# EAGLE design cft-bus-hold (EAGLE 5.11)
DRAWN_BY: Alexios; PROJECT_NAME: CFT Mini-Computer; REVISION: Rev A; SHEET_DESCRIPTION: Bus Hold; SIMULATION_FILENAME: N/A; URL: http://www.bedroomlan.org/cft
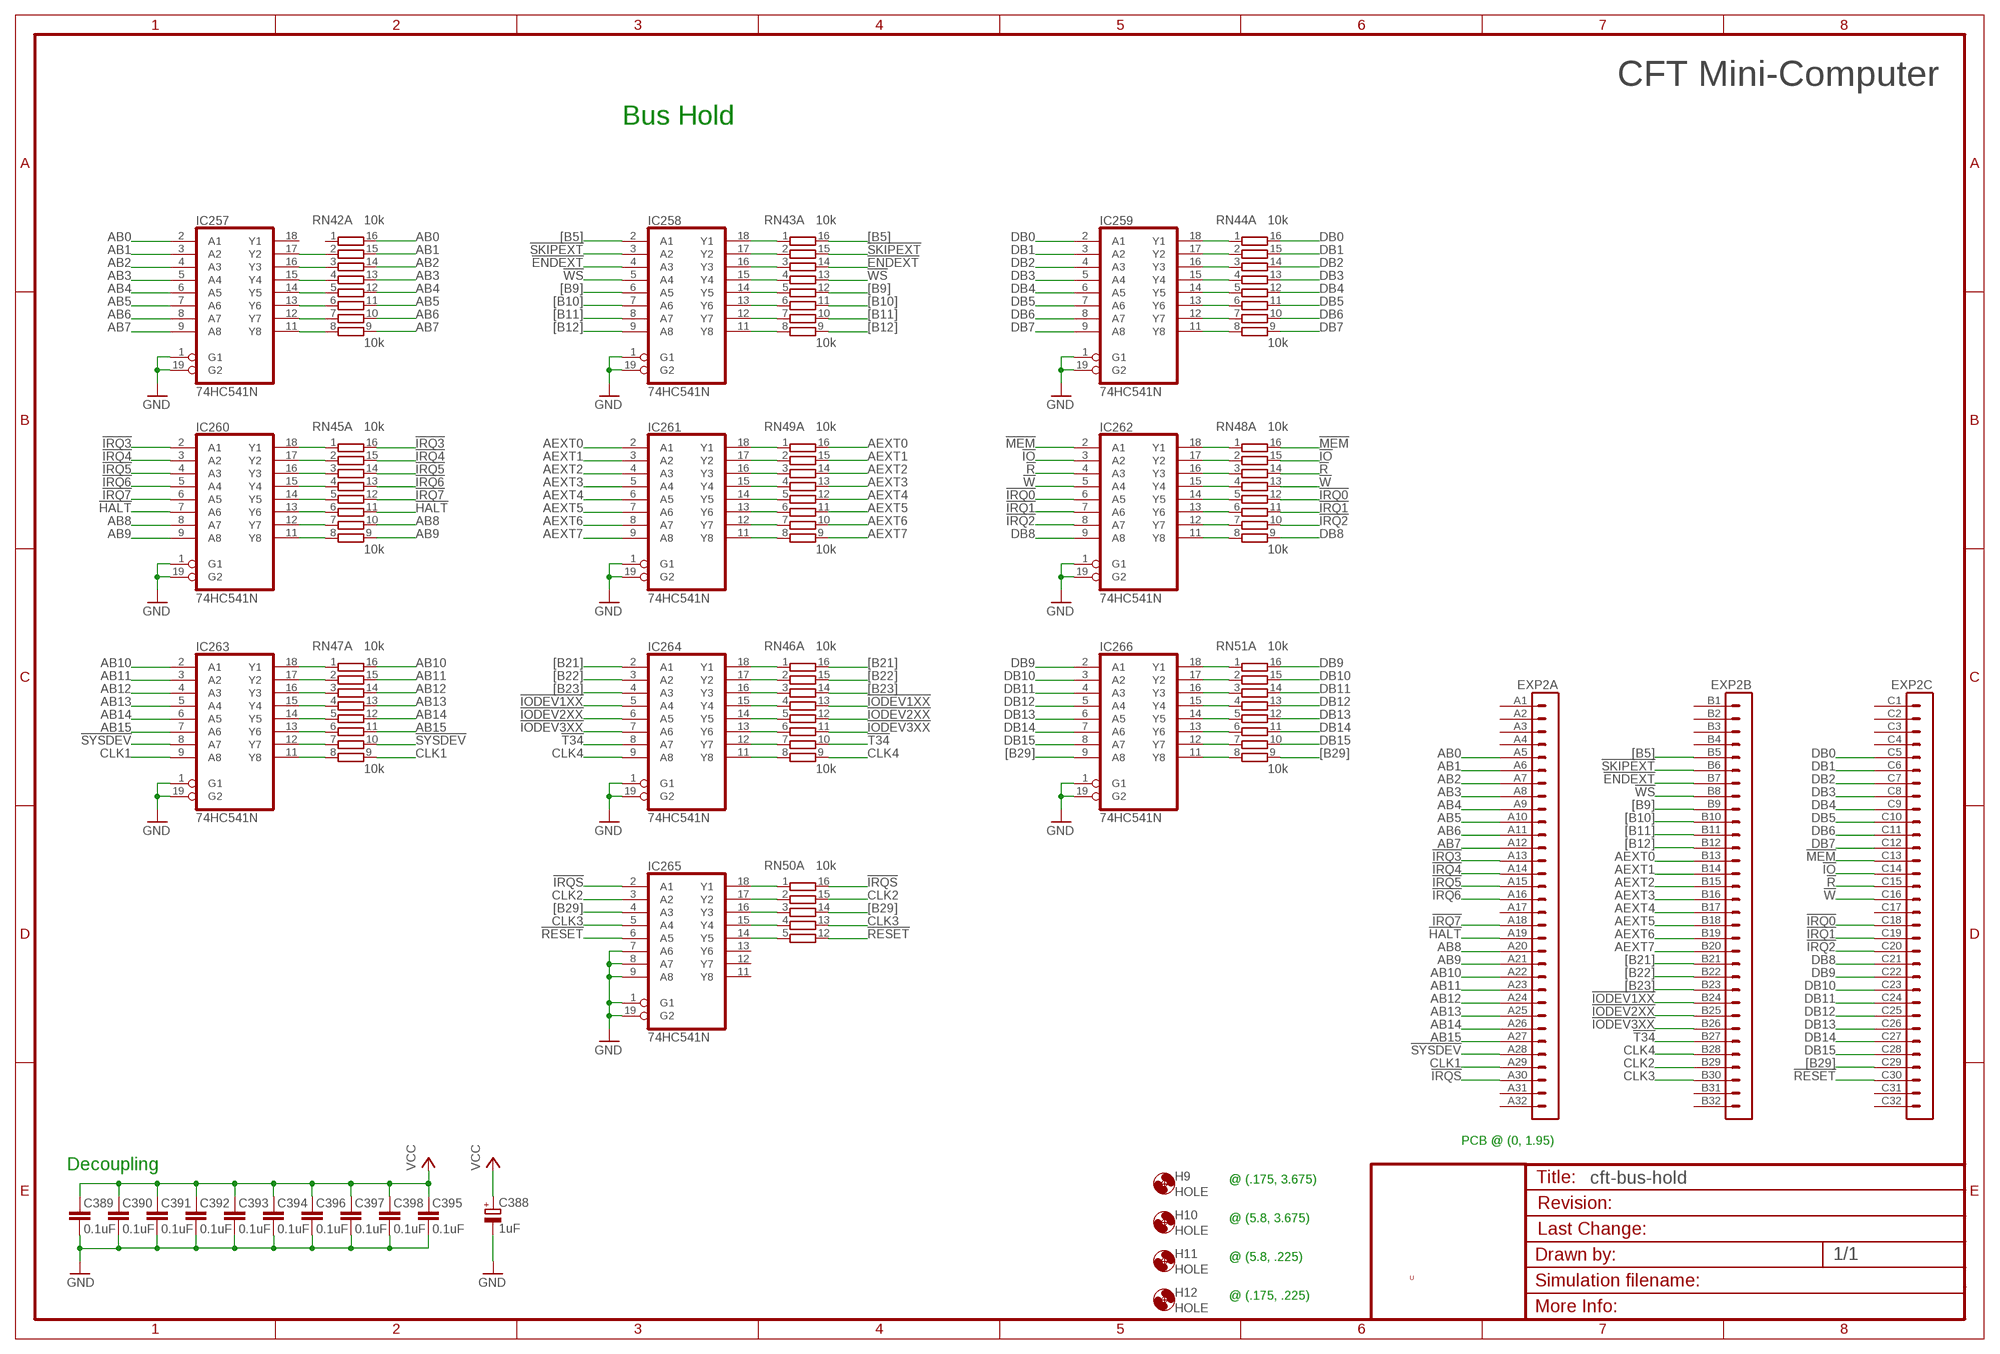
[diagram p0: schematic, sheet 1]

## Parts
C388  1uF  CPOL-EUE2.5-5  [E2,5-5]
C389  0.1uF  C-EU025-024X044  [C025-024X044]
C390  0.1uF  C-EU025-024X044  [C025-024X044]
C391  0.1uF  C-EU025-024X044  [C025-024X044]
C392  0.1uF  C-EU025-024X044  [C025-024X044]
C393  0.1uF  C-EU025-024X044  [C025-024X044]
C394  0.1uF  C-EU025-024X044  [C025-024X044]
C395  0.1uF  C-EU025-024X044  [C025-024X044]
C396  0.1uF  C-EU025-024X044  [C025-024X044]
C397  0.1uF  C-EU025-024X044  [C025-024X044]
C398  0.1uF  C-EU025-024X044  [C025-024X044]
EXP2  VG96-3K  [VG96K]
H9  HOLE  [STANDOFF_28_60]
H10  HOLE  [STANDOFF_28_60]
H11  HOLE  [STANDOFF_28_60]
H12  HOLE  [STANDOFF_28_60]
IC257  74HC541N  [DIL20]
IC258  74HC541N  [DIL20]
IC259  74HC541N  [DIL20]
IC260  74HC541N  [DIL20]
IC261  74HC541N  [DIL20]
IC262  74HC541N  [DIL20]
IC263  74HC541N  [DIL20]
IC264  74HC541N  [DIL20]
IC265  74HC541N  [DIL20]
IC266  74HC541N  [DIL20]
RN42  10k  8R-N  [DIL16]
RN43  10k  8R-N  [DIL16]
RN44  10k  8R-N  [DIL16]
RN45  10k  8R-N  [DIL16]
RN46  10k  8R-N  [DIL16]
RN47  10k  8R-N  [DIL16]
RN48  10k  8R-N  [DIL16]
RN49  10k  8R-N  [DIL16]
RN50  10k  8R-N  [DIL16]
RN51  10k  8R-N  [DIL16]

## Nets
!ENDEXT: EXP2.B7 IC258.4(A3) RN43.14
!HALT: EXP2.A19 IC260.7(A6) RN45.11
!IO: EXP2.C14 IC262.3(A2) RN48.15
!IODEV1XX: EXP2.B24 IC264.5(A4) RN46.13
!IODEV2XX: EXP2.B25 IC264.6(A5) RN46.12
!IODEV3XX: EXP2.B26 IC264.7(A6) RN46.11
!IRQ0: EXP2.C18 IC262.6(A5) RN48.12
!IRQ1: EXP2.C19 IC262.7(A6) RN48.11
!IRQ2: EXP2.C20 IC262.8(A7) RN48.10
!IRQ3: EXP2.A13 IC260.2(A1) RN45.16
!IRQ4: EXP2.A14 IC260.3(A2) RN45.15
!IRQ5: EXP2.A15 IC260.4(A3) RN45.14
!IRQ6: EXP2.A16 IC260.5(A4) RN45.13
!IRQ7: EXP2.A18 IC260.6(A5) RN45.12
!IRQS: EXP2.A30 IC265.2(A1) RN50.16
!MEM: EXP2.C13 IC262.2(A1) RN48.16
!R: EXP2.C15 IC262.4(A3) RN48.14
!RESET: EXP2.C30 IC265.6(A5) RN50.12
!SKIPEXT: EXP2.B6 IC258.3(A2) RN43.15
!SYSDEV: EXP2.A28 IC263.8(A7) RN47.10
!T34: EXP2.B27 IC264.8(A7) RN46.10
!W: EXP2.C16 IC262.5(A4) RN48.13
!WS: EXP2.B8 IC258.5(A4) RN43.13
[B5]: EXP2.B5 IC258.2(A1) RN43.16
[B9]: EXP2.B9 IC258.6(A5) RN43.12
[B10]: EXP2.B10 IC258.7(A6) RN43.11
[B11]: EXP2.B11 IC258.8(A7) RN43.10
[B12]: EXP2.B12 IC258.9(A8) RN43.9
[B21]: EXP2.B21 IC264.2(A1) RN46.16
[B22]: EXP2.B22 IC264.3(A2) RN46.15
[B23]: EXP2.B23 IC264.4(A3) RN46.14
[B29]: EXP2.C29 IC265.4(A3) IC266.9(A8) RN50.14 RN51.9
AB0: EXP2.A5 IC257.2(A1) RN42.16
AB1: EXP2.A6 IC257.3(A2) RN42.15
AB2: EXP2.A7 IC257.4(A3) RN42.14
AB3: EXP2.A8 IC257.5(A4) RN42.13
AB4: EXP2.A9 IC257.6(A5) RN42.12
AB5: EXP2.A10 IC257.7(A6) RN42.11
AB6: EXP2.A11 IC257.8(A7) RN42.10
AB7: EXP2.A12 IC257.9(A8) RN42.9
AB8: EXP2.A20 IC260.8(A7) RN45.10
AB9: EXP2.A21 IC260.9(A8) RN45.9
AB10: EXP2.A22 IC263.2(A1) RN47.16
AB11: EXP2.A23 IC263.3(A2) RN47.15
AB12: EXP2.A24 IC263.4(A3) RN47.14
AB13: EXP2.A25 IC263.5(A4) RN47.13
AB14: EXP2.A26 IC263.6(A5) RN47.12
AB15: EXP2.A27 IC263.7(A6) RN47.11
AEXT0: EXP2.B13 IC261.2(A1) RN49.16
AEXT1: EXP2.B14 IC261.3(A2) RN49.15
AEXT2: EXP2.B15 IC261.4(A3) RN49.14
AEXT3: EXP2.B16 IC261.5(A4) RN49.13
AEXT4: EXP2.B17 IC261.6(A5) RN49.12
AEXT5: EXP2.B18 IC261.7(A6) RN49.11
AEXT6: EXP2.B19 IC261.8(A7) RN49.10
AEXT7: EXP2.B20 IC261.9(A8) RN49.9
CLK1: EXP2.A29 IC263.9(A8) RN47.9
CLK2: EXP2.B29 IC265.3(A2) RN50.15
CLK3: EXP2.B30 IC265.5(A4) RN50.13
CLK4: EXP2.B28 IC264.9(A8) RN46.9
DB0: EXP2.C5 IC259.2(A1) RN44.16
DB1: EXP2.C6 IC259.3(A2) RN44.15
DB2: EXP2.C7 IC259.4(A3) RN44.14
DB3: EXP2.C8 IC259.5(A4) RN44.13
DB4: EXP2.C9 IC259.6(A5) RN44.12
DB5: EXP2.C10 IC259.7(A6) RN44.11
DB6: EXP2.C11 IC259.8(A7) RN44.10
DB7: EXP2.C12 IC259.9(A8) RN44.9
DB8: EXP2.C21 IC262.9(A8) RN48.9
DB9: EXP2.C22 IC266.2(A1) RN51.16
DB10: EXP2.C23 IC266.3(A2) RN51.15
DB11: EXP2.C24 IC266.4(A3) RN51.14
DB12: EXP2.C25 IC266.5(A4) RN51.13
DB13: EXP2.C26 IC266.6(A5) RN51.12
DB14: EXP2.C27 IC266.7(A6) RN51.11
DB15: EXP2.C28 IC266.8(A7) RN51.10
GND [low power]: C388.- C389.1 C390.1 C391.1 C392.1 C393.1 C394.1 C395.1 C396.1 C397.1 C398.1 IC257.1(G1) IC257.19(G2) IC258.1(G1) IC258.19(G2) IC259.1(G1) IC259.19(G2) IC260.1(G1) IC260.19(G2) IC261.1(G1) IC261.19(G2) IC262.1(G1) IC262.19(G2) IC263.1(G1) IC263.19(G2) IC264.1(G1) IC264.19(G2) IC265.1(G1) IC265.7(A6) IC265.8(A7) IC265.9(A8) IC265.19(G2) IC266.1(G1) IC266.19(G2)
N$1: IC258.18(Y1) RN43.1
N$2: IC257.15(Y4) RN42.4
N$7: IC257.16(Y3) RN42.3
N$8: IC257.17(Y2) RN42.2
N$10: IC266.18(Y1) RN51.1
N$11: IC257.14(Y5) RN42.5
N$12: IC257.13(Y6) RN42.6
N$55: IC257.12(Y7) RN42.7
N$61: IC257.11(Y8) RN42.8
N$67: IC258.17(Y2) RN43.2
N$68: IC258.16(Y3) RN43.3
N$69: IC258.15(Y4) RN43.4
N$77: IC258.14(Y5) RN43.5
N$200: IC258.13(Y6) RN43.6
N$208: IC258.12(Y7) RN43.7
N$209: IC258.11(Y8) RN43.8
N$210: IC259.18(Y1) RN44.1
N$211: IC259.17(Y2) RN44.2
N$212: IC259.16(Y3) RN44.3
N$213: IC259.15(Y4) RN44.4
N$214: IC259.14(Y5) RN44.5
N$215: IC259.13(Y6) RN44.6
N$216: IC259.12(Y7) RN44.7
N$217: IC259.11(Y8) RN44.8
N$218: IC260.18(Y1) RN45.1
N$219: IC260.17(Y2) RN45.2
N$220: IC260.16(Y3) RN45.3
N$221: IC260.15(Y4) RN45.4
N$222: IC260.14(Y5) RN45.5
N$223: IC260.13(Y6) RN45.6
N$224: IC260.12(Y7) RN45.7
N$225: IC260.11(Y8) RN45.8
N$226: IC264.18(Y1) RN46.1
N$227: IC264.17(Y2) RN46.2
N$228: IC264.16(Y3) RN46.3
N$229: IC264.15(Y4) RN46.4
N$230: IC264.14(Y5) RN46.5
N$231: IC264.13(Y6) RN46.6
N$232: IC264.12(Y7) RN46.7
N$233: IC264.11(Y8) RN46.8
N$258: IC263.18(Y1) RN47.1
N$266: IC263.17(Y2) RN47.2
N$267: IC263.16(Y3) RN47.3
N$268: IC263.15(Y4) RN47.4
N$269: IC263.14(Y5) RN47.5
N$270: IC263.13(Y6) RN47.6
N$272: IC263.12(Y7) RN47.7
N$275: IC263.11(Y8) RN47.8
N$276: IC262.18(Y1) RN48.1
N$289: IC262.17(Y2) RN48.2
N$482: IC262.16(Y3) RN48.3
N$521: IC262.15(Y4) RN48.4
N$522: IC262.14(Y5) RN48.5
N$523: IC262.13(Y6) RN48.6
N$524: IC262.12(Y7) RN48.7
N$525: IC262.11(Y8) RN48.8
N$526: IC261.18(Y1) RN49.1
N$528: IC261.17(Y2) RN49.2
N$529: IC261.16(Y3) RN49.3
N$530: IC261.15(Y4) RN49.4
N$534: IC261.14(Y5) RN49.5
N$535: IC261.13(Y6) RN49.6
N$536: IC261.12(Y7) RN49.7
N$537: IC261.11(Y8) RN49.8
N$538: IC265.18(Y1) RN50.1
N$540: IC265.17(Y2) RN50.2
N$848: IC265.16(Y3) RN50.3
N$849: IC265.15(Y4) RN50.4
N$857: IC265.14(Y5) RN50.5
N$861: IC266.17(Y2) RN51.2
N$862: IC266.16(Y3) RN51.3
N$863: IC266.15(Y4) RN51.4
N$864: IC266.14(Y5) RN51.5
N$865: IC266.13(Y6) RN51.6
N$866: IC266.12(Y7) RN51.7
N$867: IC266.11(Y8) RN51.8
VCC [low power]: C388.+ C389.2 C390.2 C391.2 C392.2 C393.2 C394.2 C395.2 C396.2 C397.2 C398.2
Unconnected: EXP2.A1 EXP2.A2 EXP2.A3 EXP2.A4 EXP2.A17 EXP2.A31 EXP2.A32 EXP2.B1 EXP2.B2 EXP2.B3 EXP2.B4 EXP2.B31 EXP2.B32 EXP2.C1 EXP2.C2 EXP2.C3 EXP2.C4 EXP2.C17 EXP2.C31 EXP2.C32 IC257.18(Y1) IC265.11(Y8) IC265.12(Y7) IC265.13(Y6) RN42.1 RN50.6 RN50.7 RN50.8 RN50.9 RN50.10 RN50.11

## Notes on the sheet
- CFT Mini-Computer
- Bus Hold
- PCB @ (0, 1.95)
- Decoupling
- @ (.175, 3.675)
- @ (5.8, 3.675)
- @ (5.8, .225)
- U
- @ (.175, .225)

## Power pins joined to a net without a drawn wire
GND: IC257.10(GND) IC258.10(GND) IC259.10(GND) IC260.10(GND) IC261.10(GND) IC262.10(GND) IC263.10(GND) IC264.10(GND) IC265.10(GND) IC266.10(GND)
VCC: IC257.20(VCC) IC258.20(VCC) IC259.20(VCC) IC260.20(VCC) IC261.20(VCC) IC262.20(VCC) IC263.20(VCC) IC264.20(VCC) IC265.20(VCC) IC266.20(VCC)

## Library data of the parts
C388 = rcl:CPOL-EU: POLARIZED CAPACITOR, European symbol
C389-C398 = rcl:C-EU: CAPACITOR, European symbol
EXP2 = alexios-19inch:VG96-3: PCB EUROCARD, 96-pin type C/ABC, 2.54 mm
H9-H12 = alexios:HOLE: Hole for a standoff or mount. Hole diameter: 3.3mm. External Diameter: 6mm.
IC257-IC266 = alexios:74*541: Octal BUFFER and LINE DRIVER, 3-state
RN42-RN51 = resistor-dil:8R-N: DIL RESISTOR; OC_FARNELL: unknown; OC_NEWARK: unknown

## Net classes
0 default: width 0.305 mm, clearance 0.203 mm
1 low power: width 1.27 mm, clearance 0.254 mm

## Board
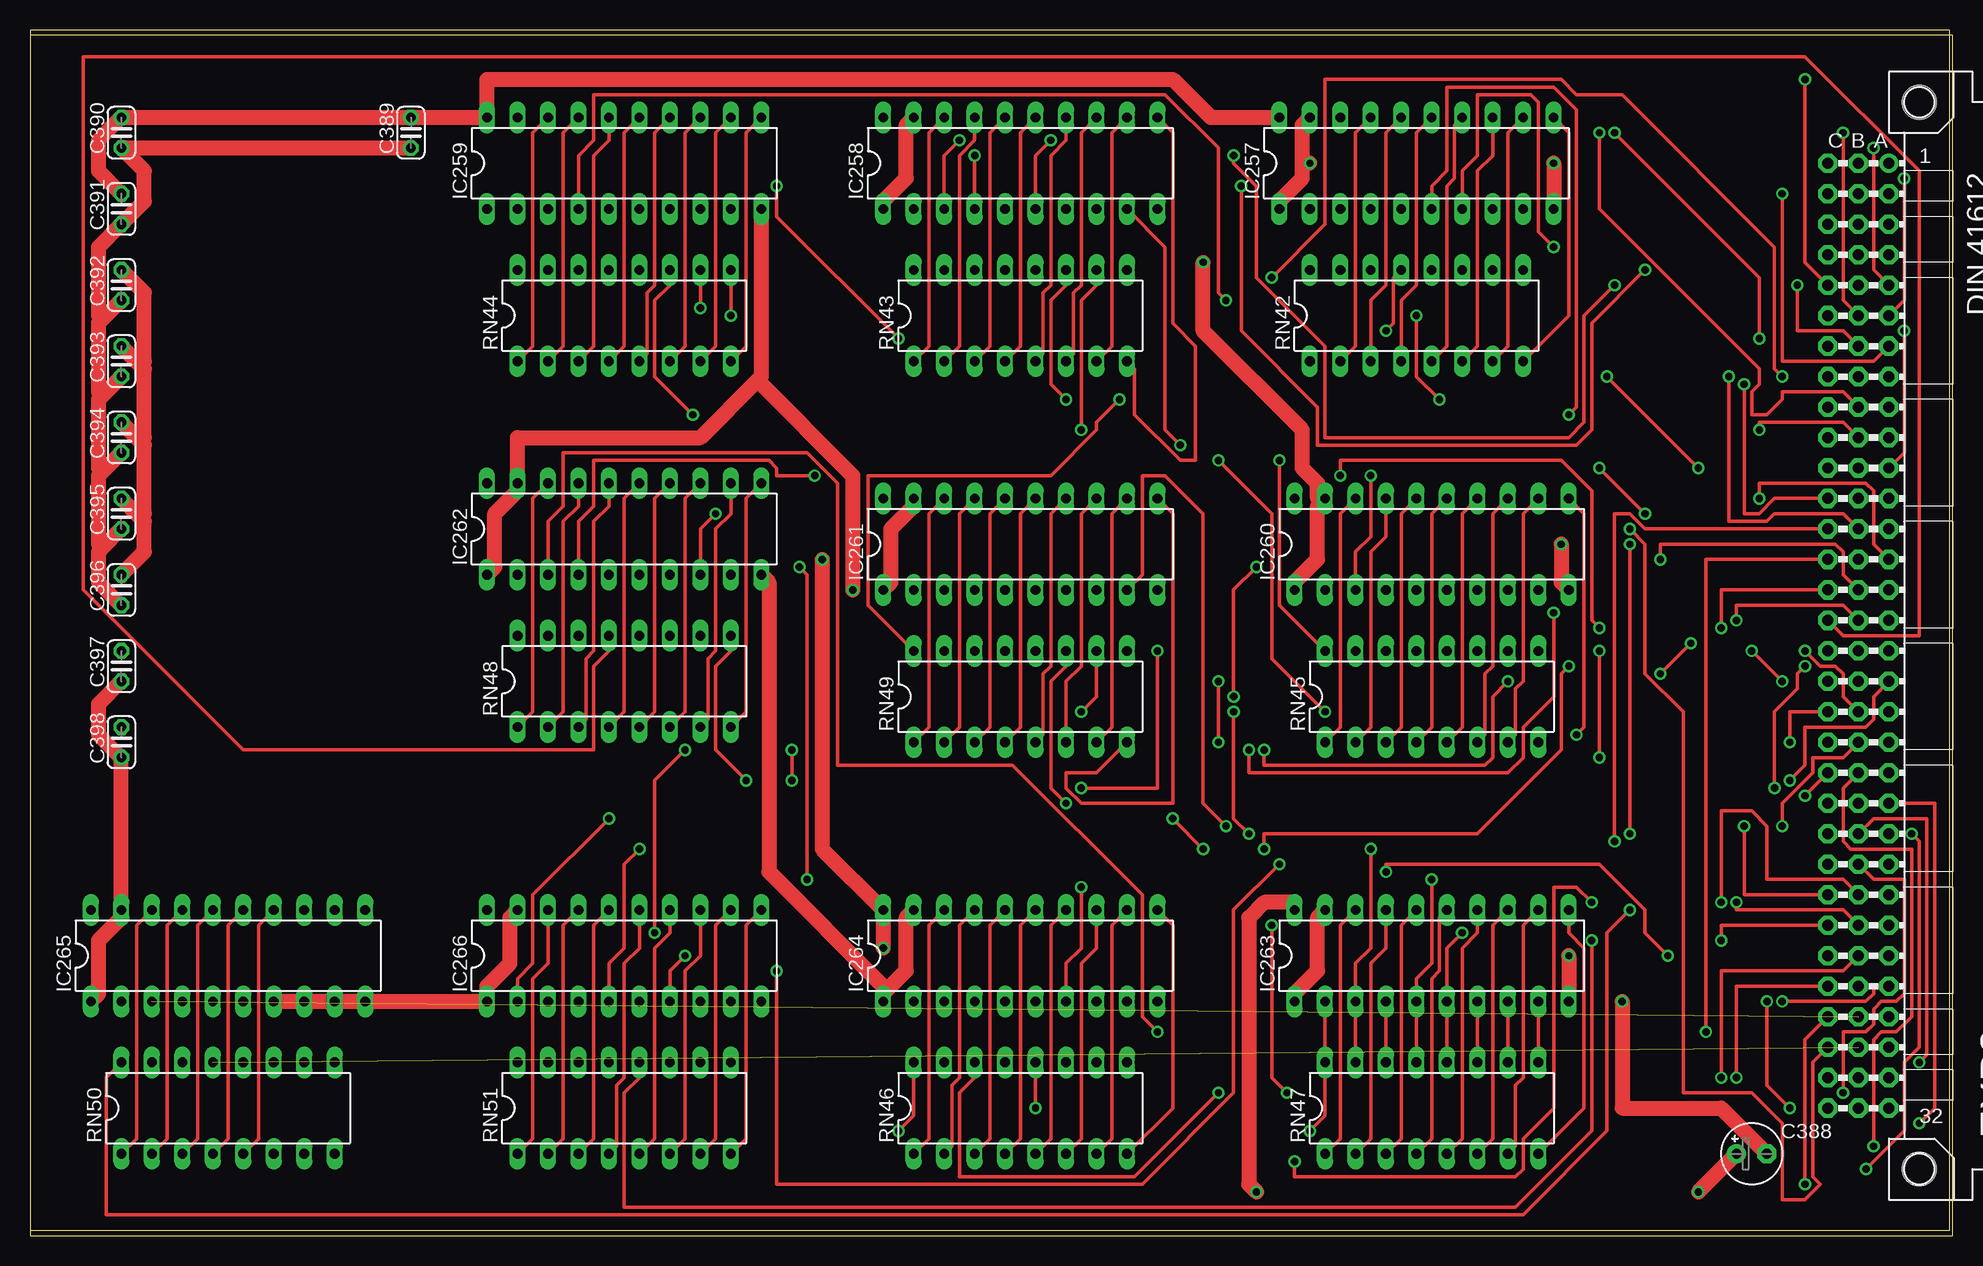
[diagram p1: board, top side]
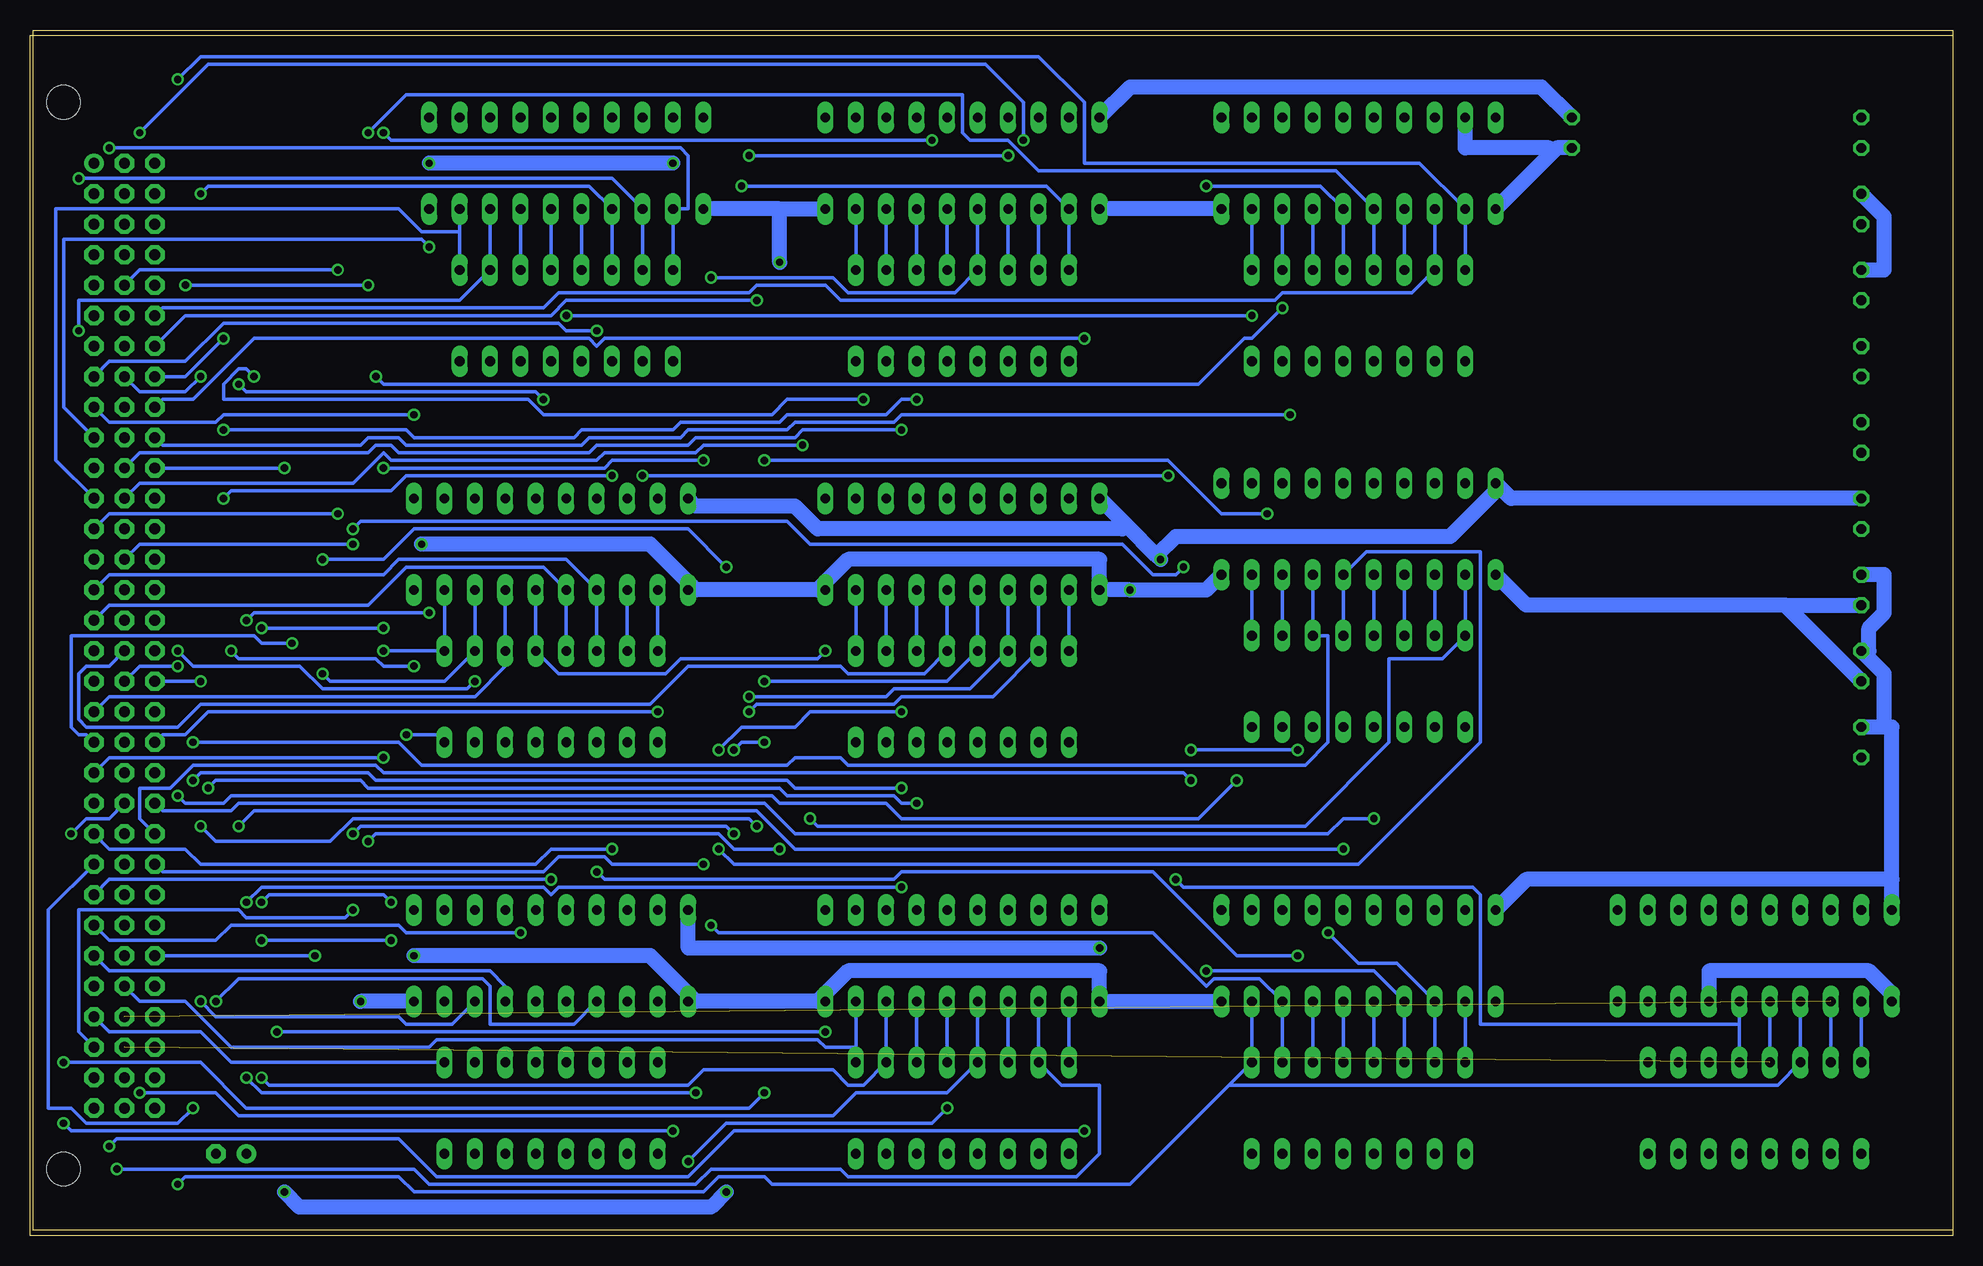
[diagram p2: board, bottom side, seen from below]

Size 160 x 100 mm. Coordinates in mm from the lower left corner, seen from the top.
Outline: 0,0 160,0 160,100 0,100 0,0
Copper layers (1*16): Top 0.035mm / dielectric 1.5mm / Bottom 0.035mm
Design rules "default": minimum track width 10mil, minimum drill 24mil, track to track 8mil, track to pad 8mil, pad to pad 8mil, via to via 8mil, smd to smd 8mil, copper to edge 40mil, drill to drill 8mil, minimum pad ring 10mil, minimum via ring 8mil, stop-mask expansion 4mil, vias tented up to drill 0mil, thermal gap 10mil

### Footprints (pad centres in the part's own frame; a part is rotated, then mirrored left to right if it is on the bottom)
E2,5-5 = drill 0.813 pad 1.6 round: + -1.27,0 | drill 0.813 pad 1.6 octagon: - 1.27,0
C025-024X044 = drill 0.813 octagon: 1 -1.27,0; 2 1.27,0
VG96K = drill 0.914 pad 1.6 round: A1 154.94,39.37 | drill 0.914 pad 1.6 octagon: A2 154.94,36.83; A3 154.94,34.29; A4 154.94,31.75; A5 154.94,29.21; A6 154.94,26.67; A7 154.94,24.13; A8 154.94,21.59; A9 154.94,19.05; A10 154.94,16.51; A11 154.94,13.97; A12 154.94,11.43; A13 154.94,8.89; A14 154.94,6.35; A15 154.94,3.81; A16 154.94,1.27; A17 154.94,-1.27; A18 154.94,-3.81; A19 154.94,-6.35; A20 154.94,-8.89; A21 154.94,-11.43; A22 154.94,-13.97; A23 154.94,-16.51; A24 154.94,-19.05; A25 154.94,-21.59; A26 154.94,-24.13; A27 154.94,-26.67; A28 154.94,-29.21; A29 154.94,-31.75; A30 154.94,-34.29; A31 154.94,-36.83; A32 154.94,-39.37; B1 152.4,39.37; B2 152.4,36.83; B3 152.4,34.29; B4 152.4,31.75; B5 152.4,29.21; B6 152.4,26.67; B7 152.4,24.13; B8 152.4,21.59; B9 152.4,19.05; B10 152.4,16.51; B11 152.4,13.97; B12 152.4,11.43; B13 152.4,8.89; B14 152.4,6.35; B15 152.4,3.81; B16 152.4,1.27; B17 152.4,-1.27; B18 152.4,-3.81; B19 152.4,-6.35; B20 152.4,-8.89; B21 152.4,-11.43; B22 152.4,-13.97; B23 152.4,-16.51; B24 152.4,-19.05; B25 152.4,-21.59; B26 152.4,-24.13; B27 152.4,-26.67; B28 152.4,-29.21; B29 152.4,-31.75; B30 152.4,-34.29; B31 152.4,-36.83; B32 152.4,-39.37; C1 149.86,39.37; C2 149.86,36.83; C3 149.86,34.29; C4 149.86,31.75; C5 149.86,29.21; C6 149.86,26.67; C7 149.86,24.13; C8 149.86,21.59; C9 149.86,19.05; C10 149.86,16.51; C11 149.86,13.97; C12 149.86,11.43; C13 149.86,8.89; C14 149.86,6.35; C15 149.86,3.81; C16 149.86,1.27; C17 149.86,-1.27; C18 149.86,-3.81; C19 149.86,-6.35; C20 149.86,-8.89; C21 149.86,-11.43; C22 149.86,-13.97; C23 149.86,-16.51; C24 149.86,-19.05; C25 149.86,-21.59; C26 149.86,-24.13; C27 149.86,-26.67; C28 149.86,-29.21; C29 149.86,-31.75; C30 149.86,-34.29; C31 149.86,-36.83; C32 149.86,-39.37 | hole 2.794: 157.48,44.45; 157.48,-44.45
STANDOFF_28_60 = hole 3.302: 0,0
DIL20 = drill 0.813 long: 1 -11.43,-3.81; 2 -8.89,-3.81; 3 -6.35,-3.81; 4 -3.81,-3.81; 5 -1.27,-3.81; 6 1.27,-3.81; 7 3.81,-3.81; 8 6.35,-3.81; 9 8.89,-3.81; 10 11.43,-3.81; 11 11.43,3.81; 12 8.89,3.81; 13 6.35,3.81; 14 3.81,3.81; 15 1.27,3.81; 16 -1.27,3.81; 17 -3.81,3.81; 18 -6.35,3.81; 19 -8.89,3.81; 20 -11.43,3.81
DIL16 = drill 0.813 long: 1 -8.89,-3.81; 2 -6.35,-3.81; 3 -3.81,-3.81; 4 -1.27,-3.81; 5 1.27,-3.81; 6 3.81,-3.81; 7 6.35,-3.81; 8 8.89,-3.81; 9 8.89,3.81; 10 6.35,3.81; 11 3.81,3.81; 12 1.27,3.81; 13 -1.27,3.81; 14 -3.81,3.81; 15 -6.35,3.81; 16 -8.89,3.81

### Placement (x,y rotation side)
C388  143.51,6.35 0 top
C389  31.75,91.44 90 top
C390  7.62,91.44 90 top
C391  7.62,85.09 90 top
C392  7.62,78.74 90 top
C393  7.62,72.39 90 top
C394  7.62,66.04 90 top
C395  7.62,59.69 90 top
C396  7.62,53.34 90 top
C397  7.62,46.99 90 top
C398  7.62,40.64 90 top
EXP2  0,49.53 0 top
H9  -104.14,180.34 0 top  (outside the outline)
H10  -110.49,180.34 0 top  (outside the outline)
H11  -116.84,180.34 0 top  (outside the outline)
H12  -123.19,180.34 0 top  (outside the outline)
IC257  115.57,88.9 0 top
IC258  82.55,88.9 0 top
IC259  49.53,88.9 0 top
IC260  116.84,57.15 0 top
IC261  82.55,57.15 0 top
IC262  49.53,58.42 0 top
IC263  116.84,22.86 0 top
IC264  82.55,22.86 0 top
IC265  16.51,22.86 0 top
IC266  49.53,22.86 0 top
RN42  115.57,76.2 0 top
RN43  82.55,76.2 0 top
RN44  49.53,76.2 0 top
RN45  116.84,44.45 0 top
RN46  82.55,10.16 0 top
RN47  116.84,10.16 0 top
RN48  49.53,45.72 0 top
RN49  82.55,44.45 0 top
RN50  16.51,10.16 0 top
RN51  49.53,10.16 0 top

### Tracks (layer width: path | path; a pad name or v marks a point on that pad's centre or on a via)
!ENDEXT  (via drill 0.61)
  Top 0.305: EXP2.B7 151.13,74.93 147.32,74.93 v147.32,78.74 | v132.08,78.74 129.54,76.2 129.54,67.31 128.27,66.04 107.95,66.04 107.95,73.66 102.23,79.38 102.23,87 100.33,88.9 v100.33,89.53 | IC258.4 v78.74,89.53
  Bottom 0.305: RN43.14 IC258.4 | v132.08,78.74 v147.32,78.74 | v78.74,89.53 v100.33,89.53
!HALT
  Bottom 0.305: IC260.7 RN45.11 120.65,46.99 123.19,44.45 153.67,44.45 EXP2.A19
!IO  (via drill 0.61)
  Top 0.305: EXP2.C14 139.7,55.88 v139.7,16.51 | v93.98,16.51 92.71,17.78 92.71,27.94 81.92,38.73 67.31,38.73 67.31,62.23 64.77,64.77 44.45,64.77 44.45,60.33 43.18,59.05 IC262.3
  Bottom 0.305: RN48.15 IC262.3 | v93.98,16.51 v139.7,16.51
!IODEV1XX  (via drill 0.61)
  Top 0.305: EXP2.B24 153.67,29.21 156.21,29.21 156.21,19.68 155.57,19.05 154.31,19.05 153.67,18.41 153.67,17.14 153.03,16.51 151.13,16.51 v151.13,11.43
  Bottom 0.305: IC264.5 RN46.13 83.82,11.43 91.44,11.43 93.34,9.53 142.88,9.53 144.78,11.43 v151.13,11.43
!IODEV2XX  (via drill 0.61)
  Top 0.305: EXP2.B25 151.13,29.21 144.78,29.21 144.78,33.66 143.51,34.92 140.97,34.92 v140.97,27.3 | v130.18,27.3 128.91,28.57 127,28.57 127,10.16 124.46,7.62 124.46,5.08 123.83,4.45 105.41,4.45 v105.41,5.71 | v83.82,10.16 RN46.12
  Bottom 0.305: RN46.12 IC264.6 | v140.97,27.3 140.34,27.94 130.81,27.94 v130.18,27.3 | v105.41,5.71 102.23,8.89 85.09,8.89 v83.82,10.16
!IODEV3XX  (via drill 0.61)
  Top 0.305: EXP2.B26 151.13,26.67 142.24,26.67 v142.24,27.3 | v87.63,28.57 87.63,23.5 86.36,22.23 IC264.7
  Bottom 0.305: RN46.11 IC264.7 | v142.24,27.3 140.97,28.57 117.47,28.57 116.84,27.94 116.2,28.57 v87.63,28.57
!IRQ0  (via drill 0.61)
  Top 0.305: v143.51,48.26 v146.05,45.72 | v128.27,46.99 127.64,46.35 127.64,40.01 120.65,33.02 102.87,33.02 v102.87,31.75
  Bottom 0.305: RN48.12 IC262.6 48.9,56.52 39.37,56.52 39.37,40.64 49.53,30.48 101.6,30.48 v102.87,31.75 | v146.05,45.72 EXP2.C18 | v143.51,48.26 142.88,47.62 131.44,47.62 130.81,46.99 v128.27,46.99
!IRQ1  (via drill 0.61)
  Top 0.305: EXP2.C19 146.69,43.18 v146.69,40.64
  Bottom 0.305: IC262.7 RN48.11 52.07,49.53 52.07,40.64 53.98,38.73 92.08,38.73 92.71,39.37 96.52,39.37 97.16,38.73 127.64,38.73 129.54,40.64 v146.69,40.64
!IRQ2  (via drill 0.61)
  Top 0.305: v107.95,43.18 103.5,47.62 103.5,59.69 v99.06,64.14 | v57.15,59.69 55.88,58.42 IC262.8
  Bottom 0.305: RN48.10 IC262.8 | EXP2.C20 149.22,41.27 147.32,41.27 145.41,43.18 v107.95,43.18 | v99.06,64.14 65.41,64.14 60.96,59.69 v57.15,59.69
!IRQ3  (via drill 0.61)
  Top 0.305: v130.81,63.5 v134.62,59.69 | v104.14,64.14 104.14,52.07 RN45.16
  Bottom 0.305: RN45.16 IC260.2 | EXP2.A13 153.67,59.69 v134.62,59.69 | v130.81,63.5 112.39,63.5 111.76,64.14 v104.14,64.14
!IRQ4  (via drill 0.61)
  Top 0.305: EXP2.A14 153.67,57.15 153.67,61.59 153.03,62.23 144.15,62.23 v144.15,60.96 | v111.76,62.87 111.76,57.78 110.49,56.52 IC260.3
  Bottom 0.305: RN45.15 IC260.3 | v144.15,60.96 143.51,61.59 130.18,61.59 128.91,62.87 v111.76,62.87
!IRQ5
  Bottom 0.305: RN45.14 IC260.4 115.57,55.88 129.54,55.88 130.81,54.61 153.67,54.61 EXP2.A15
!IRQ6
  Bottom 0.305: RN45.13 IC260.5 117.47,55.24 128.91,55.24 132.08,52.07 153.67,52.07 EXP2.A16
!IRQ7  (via drill 0.61)
  Top 0.305: EXP2.A18 153.67,44.45 153.67,42.55 153.03,41.91 147.96,41.91 147.96,38.73 v146.69,37.47 | v87.63,36.83 93.98,36.83 v93.98,48.26
  Bottom 0.305: IC260.6 RN45.12 116.2,46.35 107.31,46.35 106.05,47.62 94.61,47.62 v93.98,48.26 | v146.69,37.47 146.05,38.1 132.08,38.1 131.44,37.47 97.16,37.47 96.52,36.83 v87.63,36.83
!IRQS  (via drill 0.61)
  Top 0.305: v133.35,26.67 131.44,24.77 131.44,8.26 124.46,1.27 6.35,1.27 6.35,12.7 RN50.16
  Bottom 0.305: RN50.16 IC265.2 | EXP2.A30 156.21,16.51 156.21,26.67 142.88,26.67 142.24,26.04 133.99,26.04 v133.35,26.67
!MEM  (via drill 0.61)
  Top 0.305: EXP2.C13 134.62,58.42 133.35,59.69 132.08,59.69 v132.08,32.38 | v95.25,34.29 v97.79,31.75
  Bottom 0.305: IC262.2 RN48.16 42.55,47.62 46.99,47.62 46.99,40.64 53.98,33.66 94.61,33.66 v95.25,34.29 | v132.08,32.38 131.44,33.02 102.87,33.02 101.6,31.75 v97.79,31.75
!R  (via drill 0.61)
  Top 0.305: EXP2.C15 140.97,53.34 v140.97,50.16 | v130.81,50.16 130.18,50.8 130.18,61.59 127.64,64.14 109.22,64.14 v109.22,62.87 | v65.41,62.87 62.23,62.87 62.23,63.5 61.59,64.14 46.99,64.14 46.99,60.33 45.72,59.05 IC262.4
  Bottom 0.305: RN48.14 IC262.4 | v130.81,50.16 v140.97,50.16 | v65.41,62.87 v109.22,62.87
!RESET  (via drill 0.61)
  Top 0.305: EXP2.C30 148.59,13.97 148.59,4.45 149.22,3.81 147.96,2.54 146.05,2.54 146.05,8.89 143.51,11.43 137.79,11.43 137.79,43.18 134.62,46.35 134.62,57.15 v133.35,58.42 | v64.14,55.24 64.77,54.61 v64.77,29.21
  Bottom 0.305: RN50.12 17.78,17.14 | 17.78,17.14 IC265.6 | v133.35,58.42 132.72,59.05 97.16,59.05 95.25,57.15 69.22,57.15 66.67,54.61 64.77,54.61 v64.14,55.24 | v64.77,29.21 64.14,28.57 40.01,28.57 39.37,27.94 39.37,17.14 17.78,17.14
!SKIPEXT  (via drill 0.61)
  Top 0.305: EXP2.B6 151.13,77.47 v151.13,91.44 | v77.47,90.81 76.2,89.53 IC258.3
  Bottom 0.305: RN43.15 IC258.3 | v151.13,91.44 145.41,97.16 80.64,97.16 77.47,93.98 v77.47,90.81
!SYSDEV  (via drill 0.61)
  Top 0.305: RN47.10 IC263.8 | EXP2.A28 153.67,20.32 153.67,19.68 153.03,19.05 v146.05,19.05
  Bottom 0.305: v146.05,19.05 144.78,17.78 129.54,17.78 128.91,17.14 125.09,17.14 IC263.8
!T34  (via drill 0.61)
  Top 0.305: EXP2.B27 151.13,21.59 140.97,21.59 v140.97,12.7
  Bottom 0.305: IC264.8 RN46.10 90.81,12.06 92.08,12.06 93.34,13.34 104.14,13.34 105.41,12.06 140.34,12.06 v140.97,12.7
!W
  Top 0.305: EXP2.C16 151.13,49.53 157.48,49.53 157.48,88.27 147.96,97.79 4.45,97.79 4.45,53.34 17.78,40.01 46.99,40.01 46.99,46.99 48.26,48.26 RN48.13
  Bottom 0.305: RN48.13 IC262.5
!WS  (via drill 0.61)
  Top 0.305: v146.05,71.12 145.41,71.75 145.41,81.92 132.72,94.61 128.91,94.61 127.64,95.89 107.95,95.89 107.95,83.82 v103.5,79.38
  Bottom 0.305: IC258.5 RN43.13 83.19,78.11 92.08,78.11 93.34,79.38 v103.5,79.38 | EXP2.B8 151.13,69.85 147.32,69.85 v146.05,71.12
[B5]  (via drill 0.61)
  Top 0.305: v134.62,80.01 130.18,75.56 130.18,66.67 128.91,65.41 107.31,65.41 107.31,68.58 100.97,74.93 v100.97,87
  Bottom 0.305: RN43.16 IC258.2 75.56,87 v100.97,87 | EXP2.B5 151.13,80.01 v134.62,80.01
[B9]  (via drill 0.61)
  Top 0.305: EXP2.B9 151.13,69.85 146.05,69.85 146.05,69.22 144.78,67.94 143.51,67.94 143.51,69.85 144.15,70.48 144.15,71.75 130.81,85.09 v130.81,91.44 | v85.09,90.81 83.82,89.53 IC258.6
  Bottom 0.305: RN43.12 IC258.6 | v130.81,91.44 130.18,90.81 v85.09,90.81
[B10]  (via drill 0.61)
  Top 0.305: EXP2.B10 151.13,67.31 144.15,67.31 v144.15,66.67 | v86.36,69.22 85.09,70.48 85.09,77.47 86.36,78.74 RN43.11
  Bottom 0.305: RN43.11 IC258.7 | v144.15,66.67 128.91,66.67 128.27,66.04 114.94,66.04 114.3,66.67 106.68,66.67 106.05,67.31 97.79,67.31 97.16,67.94 88.9,67.94 87.63,69.22 v86.36,69.22
[B11]  (via drill 0.61)
  Top 0.305: v87.63,66.67 87.63,77.47 88.9,78.74 RN43.10
  Bottom 0.305: RN43.10 IC258.8 | EXP2.B11 151.13,64.77 132.08,64.77 131.44,65.41 130.18,65.41 129.54,64.77 113.67,64.77 113.03,65.41 105.41,65.41 104.78,66.04 96.52,66.04 95.89,66.67 v87.63,66.67
[B12]  (via drill 0.61)
  Top 0.305: v95.89,65.41 94.61,66.67 94.61,81.92 IC258.9
  Bottom 0.305: IC258.9 RN43.9 | EXP2.B12 151.13,62.23 133.35,62.23 130.81,64.77 130.18,64.14 113.03,64.14 112.39,64.77 104.78,64.77 104.14,65.41 v95.89,65.41
[B21]  (via drill 0.61)
  Top 0.305: EXP2.B21 151.13,36.83 151.13,32.38 151.76,31.75 156.84,31.75 156.84,17.78 155.57,16.51 154.31,16.51 153.67,15.88 v153.67,6.99 | v72.39,8.26 73.66,9.53 RN46.16
  Bottom 0.305: RN46.16 IC264.2 | v153.67,6.99 153.03,7.62 129.54,7.62 126.36,4.45 105.41,4.45 101.6,8.26 v72.39,8.26
[B22]  (via drill 0.61)
  Top 0.305: v156.84,33.02 157.48,32.38 157.48,15.24 156.21,13.97 156.21,8.26 v153.03,5.08
  Bottom 0.305: IC264.3 RN46.15 74.3,12.06 71.12,12.06 71.12,6.35 73.03,4.45 92.08,4.45 92.71,5.08 103.5,5.08 104.78,3.81 127,3.81 128.27,5.08 v153.03,5.08 | EXP2.B22 153.67,34.29 155.57,34.29 v156.84,33.02
[B23]  (via drill 0.61)
  Top 0.305: EXP2.B23 153.67,34.29 158.12,34.29 158.12,14.61 v157.48,13.97 | v99.06,11.43 92.08,4.45 77.47,4.45 77.47,11.43 78.74,12.7 RN46.14
  Bottom 0.305: RN46.14 IC264.4 | v157.48,13.97 146.05,13.97 142.24,10.16 100.33,10.16 v99.06,11.43
[B29]  (via drill 0.61)
  Top 0.305: EXP2.C29 147.96,15.88 v147.96,3.81
  Bottom 0.305: IC265.4 RN50.14 14.61,12.06 60.33,12.06 | IC266.9 RN51.9 60.33,12.06 | v147.96,3.81 147.32,4.45 129.54,4.45 128.27,3.17 104.14,3.17 102.87,4.45 99.06,4.45 98.42,3.81 68.58,3.81 60.33,12.06
AB0  (via drill 0.61)
  Top 0.305: EXP2.A5 153.67,80.01 v153.67,90.17
  Bottom 0.305: RN42.16 IC257.2 105.41,85.09 105.41,89.53 106.05,90.17 v153.67,90.17
AB1  (via drill 0.61)
  Top 0.305: EXP2.A6 156.21,77.47 v156.21,87.63
  Bottom 0.305: RN42.15 IC257.3 111.76,87.63 v156.21,87.63
AB2  (via drill 0.61)
  Top 0.305: EXP2.A7 153.67,72.39 146.05,72.39 v146.05,86.36
  Bottom 0.305: RN42.14 IC257.4 113.67,87 145.41,87 v146.05,86.36
AB3  (via drill 0.61)
  Top 0.305: v113.03,74.93 113.67,75.56 113.67,79.38 RN42.13
  Bottom 0.305: RN42.13 IC257.5 | EXP2.A8 153.67,72.39 147.32,72.39 144.15,75.56 116.2,75.56 115.57,74.93 v113.03,74.93
AB4  (via drill 0.61)
  Top 0.305: v128.27,67.94 128.91,68.58 128.91,93.34 127,95.25 118.11,95.25 118.11,88.27 116.84,87 IC257.6
  Bottom 0.305: IC257.6 RN42.12 | EXP2.A9 153.67,67.31 144.78,67.31 144.15,67.94 v128.27,67.94
AB5  (via drill 0.61)
  Top 0.305: v127,81.92 125.73,83.19 125.73,93.98 125.09,94.61 120.65,94.61 120.65,89.53 119.38,88.27 IC257.7
  Bottom 0.305: RN42.11 IC257.7 | EXP2.A10 157.48,68.58 157.48,82.55 127.64,82.55 v127,81.92
AB6  (via drill 0.61)
  Top 0.305: EXP2.A11 156.21,64.77 v156.21,74.93
  Bottom 0.305: IC257.8 RN42.10 124.46,77.47 156.21,77.47 v156.21,74.93
AB7
  Bottom 0.305: RN42.9 124.46,83.19 | 124.46,83.19 IC257.9 | EXP2.A12 158.12,64.14 158.12,85.09 129.54,85.09 127.64,83.19 124.46,83.19
AB8  (via drill 0.61)
  Top 0.305: v135.89,46.35 v138.43,48.9
  Bottom 0.305: IC260.8 RN45.10 125.73,45.72 135.25,45.72 v135.89,46.35 | EXP2.A20 155.57,41.27 156.21,41.27 156.84,41.91 156.84,49.53 141.6,49.53 140.97,48.9 v138.43,48.9
AB9  (via drill 0.61)
  Top 0.305: v130.81,39.37 v130.81,48.26
  Bottom 0.305: IC260.9 RN45.9 v130.81,48.26 | EXP2.A21 153.67,39.37 v130.81,39.37
AB10  (via drill 0.61)
  Top 0.305: IC263.2 RN47.16 107.95,9.53 v106.68,8.26 | EXP2.A22 158.75,35.56 158.75,10.16 v157.48,8.89
  Bottom 0.305: v157.48,8.89 156.84,8.26 v106.68,8.26
AB11  (via drill 0.61)
  Top 0.305: RN47.15 IC263.3 110.49,22.23 111.76,23.5 v111.76,31.75
  Bottom 0.305: EXP2.A23 153.67,31.75 147.32,31.75 146.05,30.48 118.11,30.48 116.84,31.75 v111.76,31.75
AB12  (via drill 0.61)
  Top 0.305: RN47.14 IC263.4 | v146.69,10.16 144.78,12.06 v144.78,19.05
  Bottom 0.305: EXP2.A24 158.75,26.67 158.75,10.16 156.84,10.16 155.57,8.89 147.96,8.89 v146.69,10.16 | v144.78,19.05 142.88,20.95 122.56,20.95 121.92,20.32 121.92,17.14 114.94,17.14 IC263.4
AB13  (via drill 0.61)
  Top 0.305: RN47.13 IC263.5 115.57,20.95 116.84,22.23 v116.84,29.21
  Bottom 0.305: EXP2.A25 153.67,29.21 v116.84,29.21
AB14  (via drill 0.61)
  Top 0.305: RN47.12 IC263.6 118.11,23.5 v119.38,24.77
  Bottom 0.305: EXP2.A26 153.67,24.13 144.78,24.13 143.51,25.4 129.54,25.4 128.91,24.77 v119.38,24.77
AB15
  Top 0.305: RN47.11 IC263.7
  Bottom 0.305: EXP2.A27 153.67,21.59 121.92,21.59 120.65,20.32 IC263.7
AEXT0  (via drill 0.61)
  Top 0.305: EXP2.B13 151.13,59.69 145.41,59.69 144.78,59.05 141.6,59.05 v141.6,71.12 | v90.81,69.22 88.9,67.31 88.9,66.67 85.09,62.87 69.85,62.87 69.85,52.07 RN49.16
  Bottom 0.305: RN49.16 IC261.2 | v141.6,71.12 142.24,71.75 142.88,71.75 144.15,70.48 144.15,69.22 118.75,69.22 117.47,67.94 98.42,67.94 97.16,69.22 v90.81,69.22
AEXT1  (via drill 0.61)
  Top 0.305: v133.35,33.02 v133.35,57.15 | v101.6,33.02 100.33,34.29 v100.33,43.18
  Bottom 0.305: IC261.3 RN49.15 80.01,44.45 87.63,44.45 88.27,43.81 99.69,43.81 v100.33,43.18 | EXP2.B14 151.13,57.15 v133.35,57.15 | v133.35,33.02 132.72,33.66 102.23,33.66 v101.6,33.02
AEXT2  (via drill 0.61)
  Top 0.305: EXP2.B15 151.13,54.61 151.13,56.52 150.5,57.15 135.89,57.15 v135.89,55.88 | v102.23,55.24 100.33,53.34 v100.33,44.45
  Bottom 0.305: IC261.4 RN49.14 81.92,45.09 88.27,45.09 88.9,44.45 v100.33,44.45 | v135.89,55.88 130.81,55.88 128.27,58.42 105.41,58.42 v102.23,55.24
AEXT3  (via drill 0.61)
  Top 0.305: EXP2.B16 151.13,52.07 142.24,52.07 v142.24,50.8 | v127,51.44 127,44.45 124.46,41.91 124.46,39.37 123.19,38.1 101.6,38.1 v101.6,40.01 | v99.06,45.72 v99.06,40.64
  Bottom 0.305: IC261.5 RN49.13 83.82,45.72 v99.06,45.72 | v142.24,50.8 141.6,51.44 v127,51.44 | v101.6,40.01 100.97,40.64 v99.06,40.64
AEXT4
  Bottom 0.305: IC261.6 RN49.12 85.72,46.35 92.08,46.35 92.71,46.99 105.41,46.99 108.58,43.81 146.05,43.81 147.96,41.91 155.57,41.91 156.21,42.55 156.21,46.35 155.57,46.99 153.67,46.99 EXP2.B17
AEXT5  (via drill 0.61)
  Top 0.305: v147.96,46.99 147.32,46.35 147.32,45.09 145.41,43.18 v145.41,36.83 | v86.36,35.56 85.09,36.83 85.09,45.72 86.36,46.99 RN49.11
  Bottom 0.305: RN49.11 IC261.7 | EXP2.B18 151.13,46.99 v147.96,46.99 | v145.41,36.83 144.78,37.47 132.72,37.47 132.08,36.83 97.79,36.83 97.16,36.2 88.27,36.2 87.63,35.56 v86.36,35.56
AEXT6  (via drill 0.61)
  Top 0.305: EXP2.B19 151.13,44.45 151.13,46.35 150.5,46.99 149.22,46.99 v147.96,48.26 | v123.19,45.72 121.92,44.45 121.92,39.37 121.28,38.73 102.87,38.73 v102.87,40.01 | v87.63,43.18 88.9,44.45 RN49.10
  Bottom 0.305: RN49.10 IC261.8 | v147.96,48.26 146.69,46.99 137.79,46.99 135.89,45.09 123.83,45.09 v123.19,45.72 | v102.87,40.01 100.97,41.91 96.52,41.91 95.25,43.18 v87.63,43.18
AEXT7  (via drill 0.61)
  Top 0.305: EXP2.B20 151.13,39.37 148.59,39.37 148.59,38.1 146.05,35.56 v146.05,33.66 | v99.69,33.66 97.79,35.56 97.79,59.69 94.61,62.87 92.71,62.87 92.71,54.61 IC261.9
  Bottom 0.305: IC261.9 RN49.9 | v146.05,33.66 144.78,32.38 135.25,32.38 133.35,34.29 100.33,34.29 v99.69,33.66
CLK1
  Top 0.305: RN47.9 IC263.9
  Bottom 0.305: EXP2.A29 153.67,16.51 146.05,16.51 143.51,13.97 RN47.9
CLK2  (1 unrouted)
  Bottom 0.305: RN50.15 IC265.3
CLK3  (1 unrouted)
  Bottom 0.305: RN50.13 IC265.5
CLK4
  Bottom 0.305: 91.44,15.24 IC264.9 | EXP2.B28 151.13,19.05 147.32,19.05 143.51,15.24 127,15.24 126.36,15.88 94.61,15.88 93.98,15.24 91.44,15.24 | RN46.9 91.44,15.24
DB0  (via drill 0.61)
  Top 0.305: EXP2.C5 147.96,80.64 v147.96,95.89
  Bottom 0.305: RN44.16 IC259.2 44.45,88.9 72.39,88.9 72.39,93.98 76.2,97.79 146.05,97.79 v147.96,95.89
DB1
  Bottom 0.305: IC259.3 RN44.15 45.09,78.11 55.88,78.11 56.52,77.47 92.71,77.47 93.98,78.74 99.69,78.74 100.33,78.11 116.2,78.11 117.47,76.83 149.22,76.83 EXP2.C6
DB2  (via drill 0.61)
  Top 0.305: v99.69,77.47 99.06,78.11 99.06,90.17 94.61,94.61 46.99,94.61 46.99,90.81 45.72,89.53 IC259.4
  Bottom 0.305: RN44.14 IC259.4 | EXP2.C7 147.32,76.2 116.84,76.2 115.57,77.47 v99.69,77.47
DB3  (via drill 0.61)
  Top 0.305: v132.08,91.44 144.15,79.38 v144.15,74.3
  Bottom 0.305: RN44.13 IC259.5 51.44,88.27 76.2,88.27 78.74,90.81 81.92,90.81 82.55,91.44 82.55,94.61 128.91,94.61 v132.08,91.44 | v144.15,74.3 147.32,71.12 EXP2.C8
DB4  (via drill 0.61)
  Top 0.305: v72.39,74.3 62.23,84.45 v62.23,87
  Bottom 0.305: RN44.12 IC259.6 52.7,87 v62.23,87 | EXP2.C9 149.22,69.22 146.69,69.22 141.6,74.3 113.67,74.3 113.03,73.66 112.39,74.3 v72.39,74.3
DB5  (via drill 0.61)
  Top 0.305: v55.24,67.94 52.07,71.12 52.07,77.47 53.34,78.74 RN44.11
  Bottom 0.305: RN44.11 IC259.7 | EXP2.C10 149.22,65.41 132.72,65.41 132.08,66.04 129.54,66.04 128.91,65.41 114.3,65.41 113.67,66.04 106.05,66.04 105.41,66.67 97.16,66.67 96.52,67.31 88.27,67.31 87.63,67.94 v55.24,67.94
DB6  (via drill 0.61)
  Top 0.305: v131.44,71.12 v139.06,63.5 | v55.88,76.83 RN44.10
  Bottom 0.305: RN44.10 IC259.8 | v139.06,63.5 EXP2.C11 | v131.44,71.12 130.81,70.48 62.87,70.48 59.05,74.3 58.42,74.3 v55.88,76.83
DB7  (via drill 0.61)
  Top 0.305: EXP2.C12 145.41,60.96 144.15,59.69 142.88,59.69 v142.88,70.48 | v117.47,69.22 115.57,71.12 v115.57,76.2 | v58.42,76.2 RN44.9
  Bottom 0.305: RN44.9 IC259.9 | v142.88,70.48 142.24,69.85 118.11,69.85 v117.47,69.22 | v58.42,76.2 v115.57,76.2
DB8  (via drill 0.61)
  Top 0.305: v147.96,36.2 EXP2.C21 | v59.69,37.47 57.15,40.01 57.15,46.99 58.42,48.26 RN48.9
  Bottom 0.305: RN48.9 IC262.9 | v147.96,36.2 147.32,35.56 144.15,35.56 143.51,36.2 98.42,36.2 97.79,35.56 88.9,35.56 87.63,34.29 62.87,34.29 v59.69,37.47
DB9  (via drill 0.61)
  Top 0.305: v48.26,34.29 41.91,27.94 41.91,22.23 40.64,20.95 IC266.2
  Bottom 0.305: RN51.16 IC266.2 | EXP2.C22 149.22,34.92 143.51,34.92 142.88,35.56 99.06,35.56 96.52,33.02 52.07,33.02 50.8,34.29 v48.26,34.29
DB10  (via drill 0.61)
  Top 0.305: v63.5,40.01 v63.5,37.47 | v54.61,40.01 52.07,37.47 v52.07,24.77
  Bottom 0.305: RN51.15 IC266.3 46.35,22.23 49.53,22.23 v52.07,24.77 | EXP2.C23 151.13,34.29 151.13,36.83 148.59,36.83 146.69,38.73 131.44,38.73 130.81,38.1 64.14,38.1 v63.5,37.47 | v54.61,40.01 v63.5,40.01
DB11  (via drill 0.61)
  Top 0.305: v104.14,30.48 100.33,26.67 100.33,11.43 92.71,3.81 62.23,3.81 v62.23,21.59
  Bottom 0.305: RN51.14 IC266.4 48.26,21.59 v62.23,21.59 | EXP2.C24 149.22,29.84 117.47,29.84 116.2,31.11 112.39,31.11 111.76,30.48 v104.14,30.48
DB12  (via drill 0.61)
  Top 0.305: EXP2.C25 142.88,27.94 v142.88,33.66 | v50.8,31.75 49.53,30.48 49.53,23.5 48.26,22.23 IC266.5
  Bottom 0.305: RN51.13 IC266.5 | v142.88,33.66 141.6,34.92 99.69,34.92 96.52,31.75 v50.8,31.75
DB13  (via drill 0.61)
  Top 0.305: EXP2.C26 140.97,25.4 v140.97,24.13 | v130.18,24.13 130.18,8.26 123.83,1.91 49.53,1.91 49.53,11.43 50.8,12.7 RN51.12
  Bottom 0.305: RN51.12 IC266.6 | v130.18,24.13 v140.97,24.13
DB14  (via drill 0.61)
  Top 0.305: v136.53,22.86 134.62,24.77 134.62,26.67 130.81,30.48 113.03,30.48 v113.03,29.84 | v54.61,22.86 53.34,21.59 IC266.7
  Bottom 0.305: RN51.11 IC266.7 | v136.53,22.86 EXP2.C27 | v113.03,29.84 112.39,29.21 88.27,29.21 87.63,29.84 66.67,29.84 59.69,22.86 v54.61,22.86
DB15  (via drill 0.61)
  Top 0.305: EXP2.C28 142.24,20.32 v142.24,12.7 | v104.78,11.43 103.5,12.7 v103.5,25.4
  Bottom 0.305: RN51.10 IC266.8 57.78,20.95 61.59,20.95 62.23,20.32 66.67,24.77 102.87,24.77 v103.5,25.4 | v142.24,12.7 140.97,11.43 v104.78,11.43
GND  (via drill 0.61)
  Top 1.27: IC265.7 IC265.8 IC265.9 IC265.10 IC266.1 38.1,20.32 40.01,22.23 40.01,26.04 IC266.19 | IC265.1 5.71,19.68 5.71,24.13 7.62,26.04 IC265.19 C398.1 5.71,41.27 5.71,43.81 C397.1 | IC258.19 73.03,92.08 73.03,87.63 71.12,85.72 IC258.1 | IC262.1 38.73,55.24 38.73,59.69 40.64,61.59 IC262.19 40.64,66.04 55.88,66.04 60.64,70.8 | C396.1 5.71,53.98 5.71,56.52 6.03,56.83 | 6.03,56.83 C395.1 | 6.03,63.18 5.71,62.87 5.71,57.15 6.03,56.83 | 6.03,63.18 C394.1 | 6.03,69.53 5.71,69.22 5.71,63.5 6.03,63.18 | 6.03,69.53 C393.1 | 6.03,75.88 5.71,75.56 5.71,69.85 6.03,69.53 | 6.03,75.88 C392.1 | 6.03,75.88 5.71,76.2 5.71,81.92 C391.1 9.53,85.72 9.53,88.27 C390.1 C389.1 | IC259.10 60.96,71.12 60.64,70.8 | IC264.19 73.03,26.04 73.03,21.59 71.12,19.68 IC264.1 71.12,20.32 61.59,29.84 61.59,53.98 IC262.10 | IC263.19 107.31,26.04 107.31,21.59 105.41,19.68 IC263.1 | v128.27,22.86 IC263.10 | C388.- 140.97,10.16 132.72,10.16 v132.72,19.05 | IC257.19 106.05,92.08 106.05,88.9 | 106.05,88.9 106.05,87.63 104.14,85.72 IC257.1 | v127,88.9 IC257.10 | 106.05,88.9 v106.68,88.9 | IC261.1 71.75,53.98 71.75,58.42 73.66,60.33 IC261.19 | IC260.1 105.41,53.98 107.31,55.88 107.31,60.33 IC260.19 107.31,60.96 107.31,62.23 106.05,63.5 106.05,66.67 97.79,74.93 v97.79,80.64 | IC260.10 127.64,53.98 v127.64,57.15 | v68.58,53.34 68.58,62.87 60.64,70.8
  Bottom 1.27: IC265.7 20.32,21.59 6.99,21.59 5.08,19.68 IC265.1 | IC259.10 IC258.1 | 33.34,89.85 33.02,90.17 C389.1 | 33.34,89.85 IC259.1 | IC259.19 40.64,90.17 33.66,90.17 33.34,89.85 | IC262.1 35.56,52.07 13.97,52.07 | 13.97,52.07 C396.1 | C397.1 13.97,52.07 | IC266.10 IC264.1 71.12,21.59 92.08,21.59 94.61,19.05 | 94.61,19.05 104.78,19.05 | v128.27,22.86 108.58,22.86 104.78,19.05 | 104.78,19.05 IC263.1 | IC263.10 v132.72,19.05 | 94.61,19.05 IC264.10 | 97.79,85.09 IC257.1 | 97.79,85.09 IC258.10 | v106.68,88.9 v127,88.9 | IC262.10 62.23,53.34 v68.58,53.34 IC261.1 71.12,55.88 92.08,55.88 94.61,53.34 | 94.61,53.34 104.78,53.34 | v127.64,57.15 108.58,57.15 104.78,53.34 | 104.78,53.34 IC260.1 | 94.61,53.34 IC261.10 | v97.79,80.64 97.79,85.09
N$1
  Top 0.305: RN43.1 74.93,73.66 74.93,91.44 IC258.18
N$2
  Top 0.305: RN42.4 114.3,77.47 115.57,78.74 115.57,91.44 IC257.15
N$7
  Top 0.305: RN42.3 111.76,77.47 113.03,78.74 113.03,91.44 IC257.16
N$8
  Top 0.305: RN42.2 110.49,73.66 110.49,91.44 IC257.17
N$10
  Top 0.305: RN51.1 41.91,7.62 41.91,20.95 43.18,22.23 IC266.18
N$11
  Top 0.305: RN42.5 118.11,73.66 118.11,87 118.75,87.63 118.75,92.08 IC257.14
N$12
  Top 0.305: RN42.6 120.65,73.66 120.65,88.27 121.92,89.53 IC257.13
N$55
  Top 0.305: RN42.7 123.19,73.66 123.19,91.44 IC257.12
N$61
  Top 0.305: RN42.8 128.27,76.2 128.27,91.44 IC257.11
N$67
  Top 0.305: RN43.2 77.47,73.66 77.47,89.53 78.74,90.81 IC258.17
N$68
  Top 0.305: RN43.3 80.01,73.66 80.01,91.44 IC258.16
N$69
  Top 0.305: RN43.4 82.55,73.66 82.55,91.44 IC258.15
N$77
  Top 0.305: RN43.5 84.45,73.03 84.45,78.11 85.09,78.74 85.09,89.53 86.36,90.81 IC258.14
N$200
  Top 0.305: RN43.6 87,73.03 87,78.11 87.63,78.74 87.63,91.44 IC258.13
N$208
  Top 0.305: RN43.7 90.17,73.66 90.17,91.44 IC258.12
N$209
  Top 0.305: RN43.8 92.08,71.75 92.08,67.94 95.89,64.14 97.16,64.14 97.16,73.66 95.25,75.56 95.25,91.44 IC258.11
N$210
  Top 0.305: RN44.1 41.91,73.66 41.91,91.44 IC259.18
N$211
  Top 0.305: RN44.2 44.45,73.66 44.45,91.44 IC259.17
N$212
  Top 0.305: RN44.3 46.99,73.66 46.99,89.53 48.26,90.81 IC259.16
N$213
  Top 0.305: RN44.4 49.53,73.66 49.53,91.44 IC259.15
N$214
  Top 0.305: RN44.5 51.44,73.03 51.44,78.11 52.07,78.74 52.07,91.44 IC259.14
N$215
  Top 0.305: RN44.6 54.61,73.66 54.61,91.44 IC259.13
N$216
  Top 0.305: RN44.7 57.15,73.66 57.15,91.44 IC259.12
N$217
  Top 0.305: RN44.8 59.69,73.66 59.69,91.44 IC259.11
N$218
  Top 0.305: RN45.1 109.22,41.91 109.22,59.69 IC260.18
N$219
  Top 0.305: RN45.2 111.76,41.91 111.76,56.52 113.03,57.78 IC260.17
N$220
  Top 0.305: RN45.3 114.3,41.91 114.3,59.69 IC260.16
N$221
  Top 0.305: RN45.4 116.84,41.91 116.84,59.69 IC260.15
N$222
  Top 0.305: RN45.5 119.38,41.91 119.38,59.69 IC260.14
N$223
  Top 0.305: RN45.6 121.28,41.27 121.28,46.35 121.92,46.99 121.92,59.69 IC260.13
N$224
  Top 0.305: RN45.7 123.83,41.27 123.83,45.09 124.46,45.72 124.46,59.69 IC260.12
N$225  (via drill 0.61)
  Top 0.305: v128.91,41.27 129.54,41.91 129.54,59.69 IC260.11
  Bottom 0.305: RN45.8 126.36,41.27 v128.91,41.27
N$226
  Top 0.305: RN46.1 74.93,7.62 74.93,25.4 IC264.18
N$227
  Top 0.305: RN46.2 76.83,6.99 76.83,12.06 77.47,12.7 77.47,25.4 IC264.17
N$228
  Top 0.305: RN46.3 80.01,7.62 80.01,25.4 IC264.16
N$229
  Top 0.305: RN46.4 82.55,7.62 82.55,25.4 IC264.15
N$230
  Top 0.305: RN46.5 85.09,7.62 85.09,25.4 IC264.14
N$231
  Top 0.305: RN46.6 87.63,7.62 87.63,22.23 88.9,23.5 IC264.13
N$232
  Top 0.305: RN46.7 90.17,7.62 90.17,25.4 IC264.12
N$233
  Top 0.305: RN46.8 95.25,10.16 95.25,25.4 IC264.11
N$258
  Top 0.305: RN47.1 109.22,7.62 109.22,25.4 IC263.18
N$266
  Top 0.305: RN47.2 111.76,7.62 111.76,22.23 113.03,23.5 IC263.17
N$267
  Top 0.305: RN47.3 114.3,7.62 114.3,25.4 IC263.16
N$268
  Top 0.305: RN47.4 116.84,7.62 116.84,20.95 117.47,21.59 117.47,26.04 IC263.15
N$269
  Top 0.305: RN47.5 119.38,7.62 119.38,23.5 120.65,24.77 IC263.14
N$270
  Top 0.305: RN47.6 121.92,7.62 121.92,25.4 IC263.13
N$272
  Top 0.305: RN47.7 123.83,6.99 123.83,12.06 124.46,12.7 124.46,25.4 IC263.12
N$275
  Top 0.305: RN47.8 129.54,10.16 129.54,23.5 128.27,24.77 IC263.11
N$276
  Top 0.305: RN48.1 41.91,43.18 41.91,60.96 IC262.18
N$289
  Top 0.305: RN48.2 44.45,43.18 44.45,59.05 45.72,60.33 IC262.17
N$482
  Top 0.305: RN48.3 46.35,42.55 46.35,47.62 46.99,48.26 46.99,59.05 48.26,60.33 IC262.16
N$521
  Top 0.305: RN48.4 49.53,43.18 49.53,60.96 IC262.15
N$522
  Top 0.305: RN48.5 52.07,43.18 52.07,60.96 IC262.14
N$523
  Top 0.305: RN48.6 54.61,43.18 54.61,60.96 IC262.13
N$524
  Top 0.305: RN48.7 56.52,42.55 56.52,47.62 57.15,48.26 57.15,58.42 58.42,59.69 IC262.12
N$525
  Top 0.305: RN48.8 59.69,43.18 59.69,60.96 IC262.11
N$526
  Top 0.305: RN49.1 74.93,41.91 74.93,59.69 IC261.18
N$528
  Top 0.305: RN49.2 77.47,41.91 77.47,59.69 IC261.17
N$529
  Top 0.305: RN49.3 80.01,41.91 80.01,59.69 IC261.16
N$530
  Top 0.305: RN49.4 82.55,41.91 82.55,59.69 IC261.15
N$534
  Top 0.305: RN49.5 84.45,41.27 84.45,46.35 85.09,46.99 85.09,59.69 IC261.14
N$535
  Top 0.305: RN49.6 86.36,45.72 87.63,46.99 87.63,59.69 IC261.13
N$536
  Top 0.305: RN49.7 90.17,41.91 90.17,59.69 IC261.12
N$537
  Top 0.305: RN49.8 88.9,38.1 86.36,38.1 86.36,36.83 87.63,35.56 95.25,35.56 95.25,59.69 IC261.11
N$538
  Top 0.305: RN50.1 8.89,7.62 8.89,25.4 IC265.18
N$540
  Top 0.305: RN50.2 11.43,7.62 11.43,25.4 IC265.17
N$848
  Top 0.305: RN50.3 13.97,7.62 13.97,25.4 IC265.16
N$849
  Top 0.305: RN50.4 16.51,7.62 16.51,25.4 IC265.15
N$857
  Top 0.305: RN50.5 19.05,7.62 19.05,25.4 IC265.14
N$861
  Top 0.305: RN51.2 44.45,7.62 44.45,25.4 IC266.17
N$862
  Top 0.305: RN51.3 46.99,7.62 46.99,25.4 IC266.16
N$863
  Top 0.305: RN51.4 48.9,6.99 48.9,12.06 49.53,12.7 49.53,22.23 50.8,23.5 IC266.15
N$864
  Top 0.305: RN51.5 52.07,7.62 52.07,23.5 53.34,24.77 IC266.14
N$865
  Top 0.305: RN51.6 54.61,7.62 54.61,21.59 55.88,22.86 IC266.13
N$866
  Top 0.305: RN51.7 57.15,7.62 57.15,25.4 IC266.12
N$867
  Top 0.305: RN51.8 59.69,7.62 59.69,25.4 IC266.11
VCC  (via drill 0.61)
  Top 1.27: v66.04,55.88 66.04,31.75 IC264.20 v71.12,23.5 | v139.06,3.17 C388.+ | v102.23,3.17 101.6,3.81 101.6,26.04 102.87,27.3 105.41,27.3 IC263.20 | IC257.20 98.42,92.71 95.25,95.89 38.1,95.89 IC259.20 C389.2 C390.2 5.71,90.81 5.71,88.27 C391.2 | C396.2 9.53,56.52 9.53,59.05 9.21,59.37 | 9.21,59.37 C395.2 | 9.21,65.72 9.53,65.41 9.53,59.69 9.21,59.37 | 9.21,65.72 C394.2 | 9.21,72.07 9.53,71.75 9.53,66.04 9.21,65.72 | 9.21,72.07 C393.2 | C392.2 9.53,78.11 9.53,72.39 9.21,72.07
  Bottom 1.27: 68.9,58.74 IC261.20 | 66.36,56.2 68.9,58.74 | 66.36,56.2 v66.04,55.88 | IC263.20 105.41,23.5 v71.12,23.5 | IC260.20 104.78,60.33 96.52,60.33 94.61,58.42 69.22,58.42 68.9,58.74 | v139.06,3.17 137.79,1.91 103.5,1.91 v102.23,3.17 | IC258.20 68.58,95.25 34.29,95.25 C389.2 | 5.08,29.21 5.08,41.91 5.71,41.91 | IC265.20 5.08,29.21 | 5.71,41.91 C398.2 | 5.71,41.91 5.71,46.35 C397.2 6.99,48.26 6.99,50.16 5.71,51.44 5.71,54.61 C396.2 | IC266.20 35.56,29.21 5.08,29.21 | C395.2 36.83,60.96 IC262.20 38.1,61.59 41.91,57.78 64.77,57.78 66.36,56.2 | C391.2 5.71,84.45 5.71,80.01 C392.2